# Altium schematic sheet [01] - Connectors.SchDoc
size A2
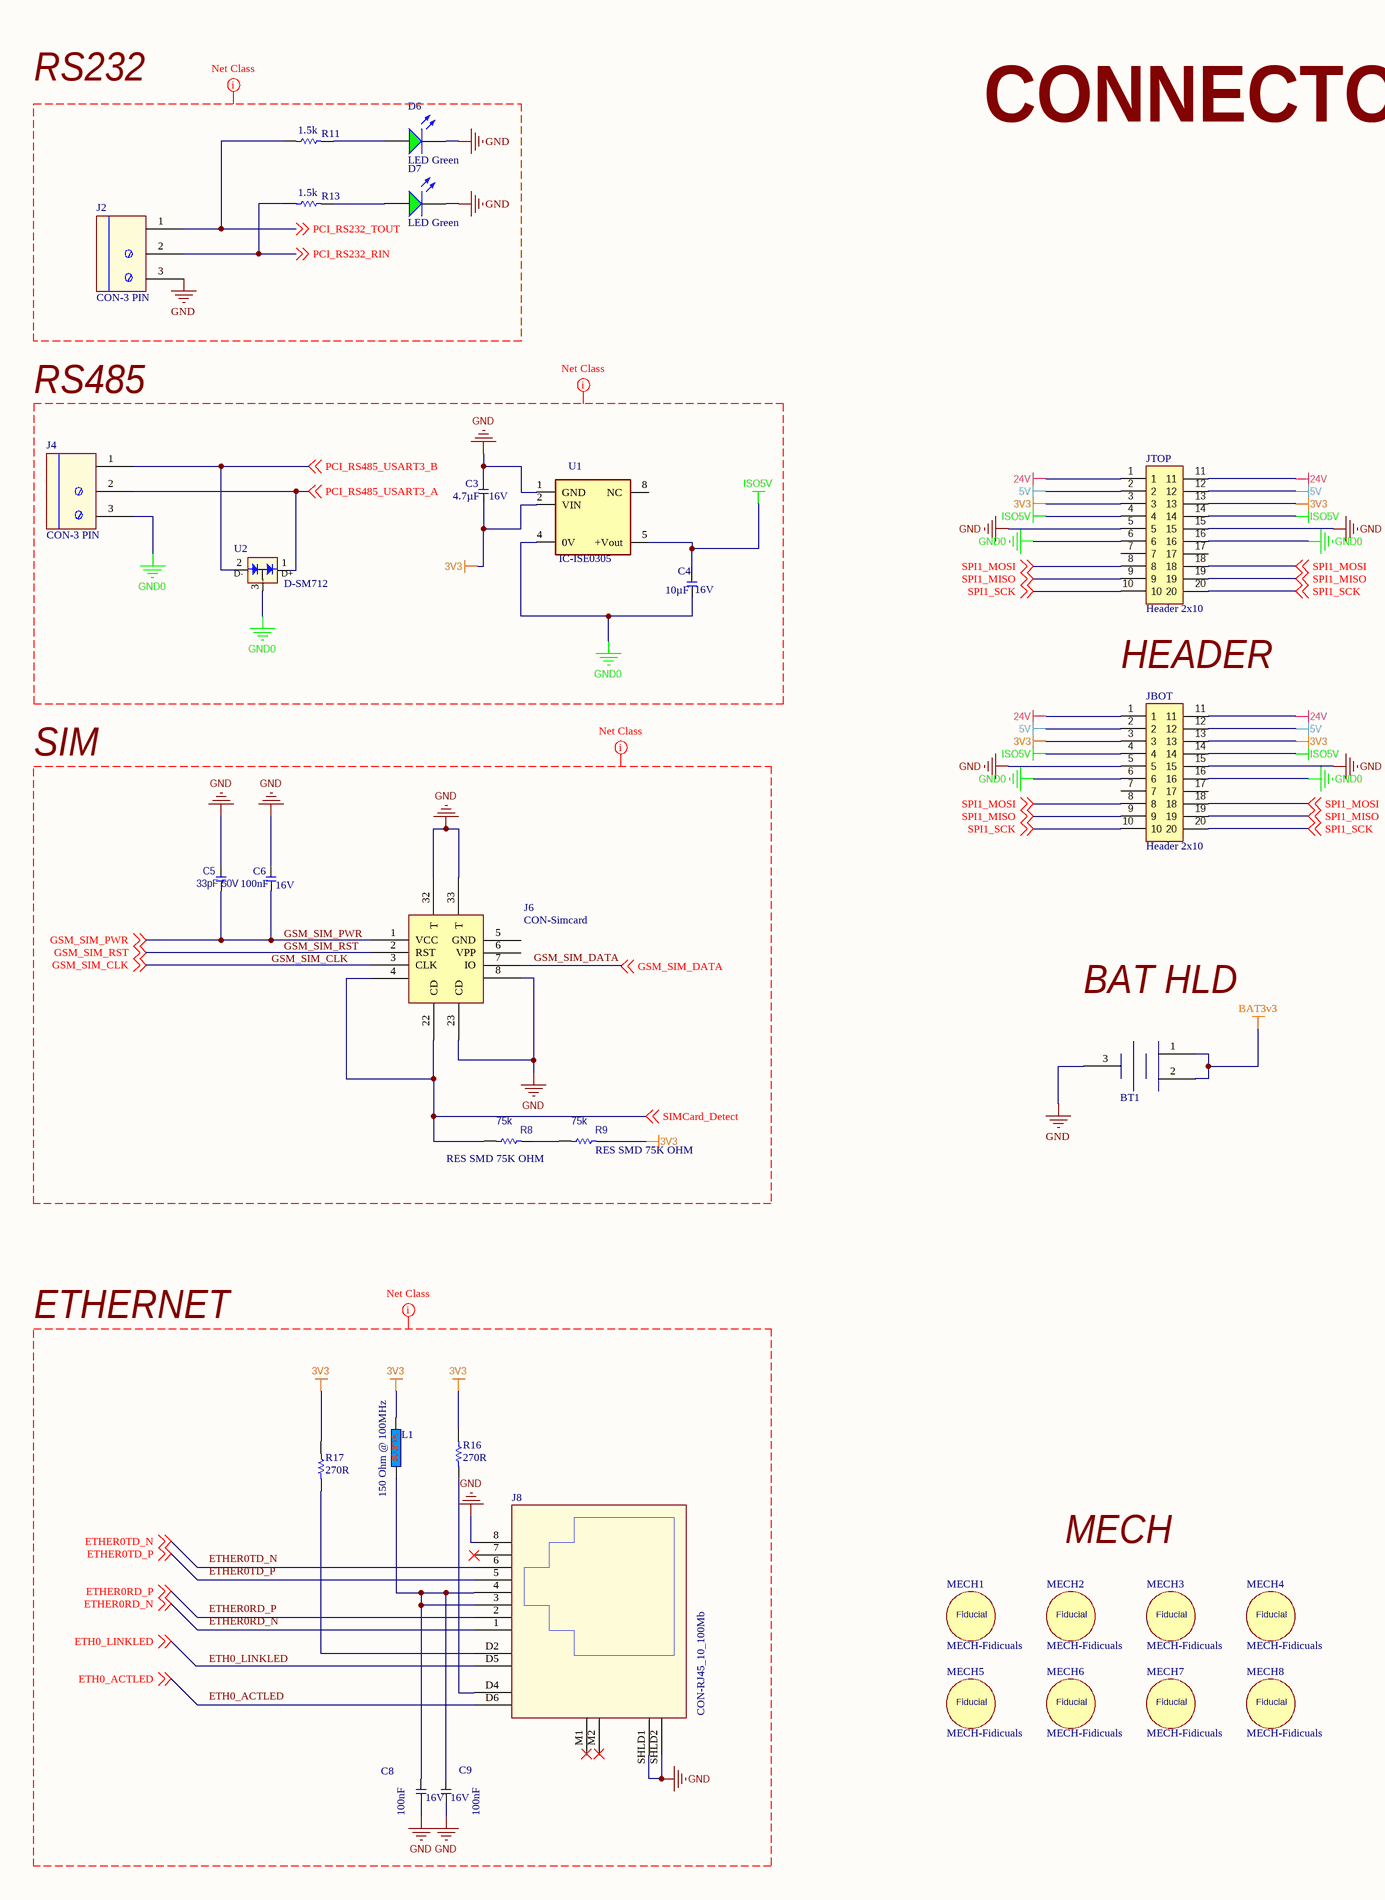
[diagram p0: [01] - Connectors.SchDoc, left]
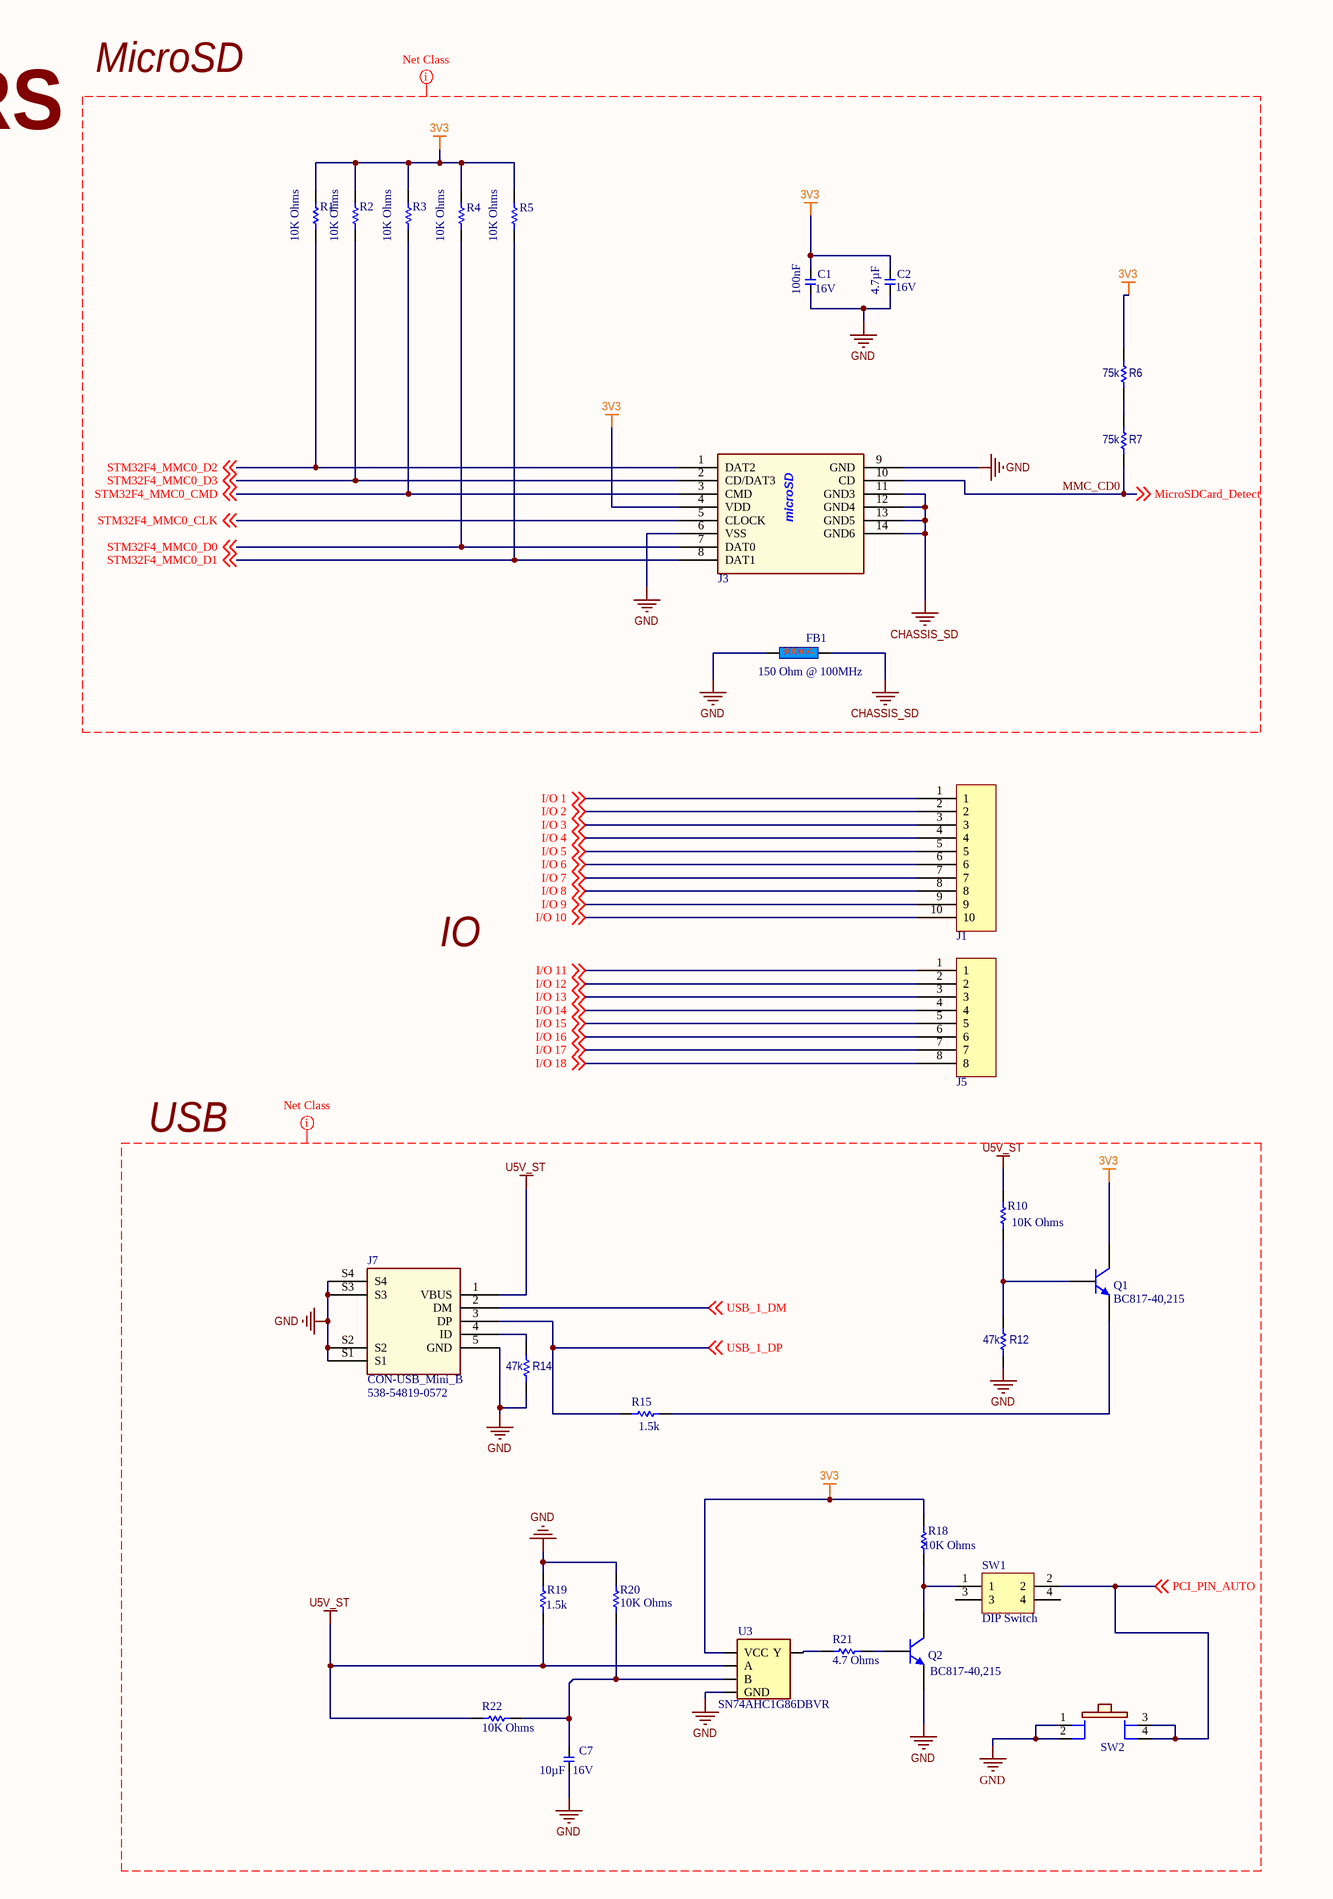
[diagram p1: [01] - Connectors.SchDoc, right]

## Parts
BT1  2032  [2032 SMT Bulk]  (value not drawn)
C1  100nF  Voltage - Rated: 16V  [C0805]
C2  4.7µF  Voltage - Rated: 16V  [C0805]
C3  4.7µF  Voltage - Rated: 16V  [C0805]
C4  10µF  Voltage - Rated: 16V  [C0805]
C5  Capacitance: 33pF  Voltage - Rated: 50V  [C0805]  (hidden comment: CAP CER 33PF 50V)
C6  100nF  Voltage - Rated: 16V  [C0805]
C7  10µF  Voltage - Rated: 16V  [C0805]
C8  100nF  Voltage - Rated: 16V  [C0805]
C9  100nF  Voltage - Rated: 16V  [C0805]
D6  LED Green  [LED_0805]
D7  LED Green  [LED_0805]
FB1  150 Ohm @ 100MHz  [0805]
J1  CON-10 PIN  [Connector_10_pin]  (value not drawn)
J2  CON-3 PIN  [CONECTOR_PCB_3_90_3.81mm]
J3  CONN MICRO SD CARD PUSH-PUSH R/A  [microSD]  (value not drawn)
J4  CON-3 PIN  [CONECTOR_PCB_3_90_3.81mm]
J5  CON-8 PIN  [CONECTOR_PCB_10_3.81_90]  (value not drawn)
J6  CON-Simcard  [SIMCARD]
J7  CON-USB_Mini_B  Supplier Part Number 1: 538-54819-0572  [USB MINI TYPE B]
J8  CON-RJ45_10_100Mb  [6605728-1]
JBOT  Header 2x10  [Header 2x10 2mm]
JTOP  Header 2x10  [Header 2x10 2mm]
L1  150 Ohm @ 100MHz  [0805]
MECH1  MECH-Fidicuals  [T-Fidicuals]
MECH2  MECH-Fidicuals  [T-Fidicuals]
MECH3  MECH-Fidicuals  [T-Fidicuals]
MECH4  MECH-Fidicuals  [T-Fidicuals]
MECH5  MECH-Fidicuals  [T-Fidicuals]
MECH6  MECH-Fidicuals  [T-Fidicuals]
MECH7  MECH-Fidicuals  [T-Fidicuals]
MECH8  MECH-Fidicuals  [T-Fidicuals]
Q1  BC817-40,215  [SO-G3/Y1]
Q2  BC817-40,215  [SO-G3/Y1]
R1  10K Ohms  [R0805]
R2  10K Ohms  [R0805]
R3  10K Ohms  [R0805]
R4  10K Ohms  [R0805]
R5  10K Ohms  [R0805]
R6  Resistance (Ohms): 75k  [R1206]  (hidden comment: RES SMD 75K OHM)
R7  Resistance (Ohms): 75k  [R1206]  (hidden comment: RES SMD 75K OHM)
R8  RES SMD 75K OHM  Resistance (Ohms): 75k  [R1206]
R9  RES SMD 75K OHM  Resistance (Ohms): 75k  [R1206]
R10  10K Ohms  [R0805]
R11  1.5k  [R0805]
R12  Resistance (Ohms): 47k  [R0805]  (hidden comment: RES SMD 47K OHM)
R13  1.5k  [R0805]
R14  Resistance (Ohms): 47k  [R0805]  (hidden comment: RES SMD 47K OHM)
R15  1.5k  [R0805]
R16  270R  [R0805]
R17  270R  [R0805]
R18  10K Ohms  [R0805]
R19  1.5k  [R0805]
R20  10K Ohms  [R0805]
R21  4.7 Ohms  [R0805]
R22  10K Ohms  [R0805]
SW1  DIP Switch  [DIP Switch]
SW2  Switch_Pushbutton_smd  [SW_B3SL-1022P]  (value not drawn)
U1  IC-ISE0305  [DC DC]
U2  D-SM712  [SM712 Sot23-3]
U3  Manufacturer Part Number: SN74AHC1G86DBVR  [SOT23-5]  (hidden comment: IC-SN74AHC1G86DBVR XOR)

## Nets
3V3: C1.2 C2.2 C3.1 J3.4(VDD) JBOT.3 JBOT.13 JTOP.3 JTOP.13 L1.2 Q1.3(C) R1.2 R2.2 R3.2 R4.2 R5.2 R6.2 R9.2 R16.1 R17.2 R18.2 U1.2(VIN) U3.5(VCC)
5V: JBOT.2 JBOT.12 JTOP.2 JTOP.12
24V: JBOT.1 JBOT.11 JTOP.1 JTOP.11
BAT3v3: BT1.1 BT1.2
CHASSIS_SD: FB1.2 J3.11(GND3) J3.12(GND4) J3.13(GND5) J3.14(GND6)
GND: BT1.3 C1.1 C2.1 C3.2 C5.2 C6.2 C7.1 C8.1 C9.1 D6.1(K) D7.1(K) FB1.1 J2.3 J3.6(VSS) J3.9(GND) J6.8 J6.23(CD) J6.32(T) J6.33(T) J7.5(GND) J7.S1 J7.S2 J7.S3 J7.S4 J8.8 J8.SHLD1 J8.SHLD2 JBOT.5 JBOT.15 JTOP.5 JTOP.15 Q2.2(E) R12.2 R14.2 R19.2 R20.2 SW2.1 SW2.2 U1.1(GND) U3.3(GND)
GND0: C4.2 J4.3 JBOT.6 JBOT.16 JTOP.6 JTOP.16 U1.4(0V) U2.3
ISO5V: C4.1 JBOT.4 JBOT.14 JTOP.4 JTOP.14 U1.5(+Vout)
U5V_ST: J7.1(VBUS) R10.2 R19.1 R22.2 U3.1(A)
ETH0_ACTLED: J8.D6 ; off-sheet ETH0_ACTLED
ETH0_LINKLED: J8.D5 ; off-sheet ETH0_LINKLED
ETHER0RD_N: J8.1 ; off-sheet ETHER0RD_N
ETHER0RD_P: J8.2 ; off-sheet ETHER0RD_P
ETHER0TD_N: J8.6 ; off-sheet ETHER0TD_N
ETHER0TD_P: J8.5 ; off-sheet ETHER0TD_P
GSM_SIM_CLK: J6.3(CLK) ; off-sheet GSM_SIM_CLK
GSM_SIM_DATA: J6.7(IO) ; off-sheet GSM_SIM_DATA
GSM_SIM_PWR: C5.1 C6.1 J6.1(VCC) ; off-sheet GSM_SIM_PWR
GSM_SIM_RST: J6.2(RST) ; off-sheet GSM_SIM_RST
I/O 1: J1.1 ; off-sheet I/O 1
I/O 2: J1.2 ; off-sheet I/O 2
I/O 3: J1.3 ; off-sheet I/O 3
I/O 4: J1.4 ; off-sheet I/O 4
I/O 5: J1.5 ; off-sheet I/O 5
I/O 6: J1.6 ; off-sheet I/O 6
I/O 7: J1.7 ; off-sheet I/O 7
I/O 8: J1.8 ; off-sheet I/O 8
I/O 9: J1.9 ; off-sheet I/O 9
I/O 10: J1.10 ; off-sheet I/O 10
I/O 11: J5.1 ; off-sheet I/O 11
I/O 12: J5.2 ; off-sheet I/O 12
I/O 13: J5.3 ; off-sheet I/O 13
I/O 14: J5.4 ; off-sheet I/O 14
I/O 15: J5.5 ; off-sheet I/O 15
I/O 16: J5.6 ; off-sheet I/O 16
I/O 17: J5.7 ; off-sheet I/O 17
I/O 18: J5.8 ; off-sheet I/O 18
MMC_CD0: J3.10(CD) R7.1 ; off-sheet MicroSDCard_Detect  [also labelled MicroSDCard_Detect]
PCI_PIN_AUTO: SW1.2 SW2.3 SW2.4 ; off-sheet PCI_PIN_AUTO
PCI_RS232_RIN: J2.2 R13.1 ; off-sheet PCI_RS232_RIN
PCI_RS232_TOUT: J2.1 R11.1 ; off-sheet PCI_RS232_TOUT
PCI_RS485_USART3_A: J4.2 U2.1(D+) ; off-sheet PCI_RS485_USART3_A
PCI_RS485_USART3_B: J4.1 U2.2(D-) ; off-sheet PCI_RS485_USART3_B
SIMCard_Detect: J6.4 J6.22(CD) R8.1 ; off-sheet SIMCard_Detect
SPI1_MISO: JBOT.9 JBOT.19 JTOP.9 JTOP.19 ; off-sheet SPI1_MISO
SPI1_MOSI: JBOT.8 JBOT.18 JTOP.8 JTOP.18 ; off-sheet SPI1_MOSI
SPI1_SCK: JBOT.10 JBOT.20 JTOP.10 JTOP.20 ; off-sheet SPI1_SCK
STM32F4_MMC0_CLK: J3.5(CLOCK) ; off-sheet STM32F4_MMC0_CLK
STM32F4_MMC0_CMD: J3.3(CMD) R3.1 ; off-sheet STM32F4_MMC0_CMD
STM32F4_MMC0_D0: J3.7(DAT0) R4.1 ; off-sheet STM32F4_MMC0_D0
STM32F4_MMC0_D1: J3.8(DAT1) R5.1 ; off-sheet STM32F4_MMC0_D1
STM32F4_MMC0_D2: J3.1(DAT2) R1.1 ; off-sheet STM32F4_MMC0_D2
STM32F4_MMC0_D3: J3.2(CD/DAT3) R2.1 ; off-sheet STM32F4_MMC0_D3
USB_1_DM: J7.2(DM) ; off-sheet USB_1_DM
USB_1_DP: J7.3(DP) R15.1 ; off-sheet USB_1_DP
NetC7_2: C7.2 R20.1 R22.1 U3.2(B)
NetC8_2: C8.2 C9.2 J8.3 J8.4 L1.1
NetD6_2: D6.2(A) R11.2
NetD7_2: D7.2(A) R13.2
NetJ7_4: J7.4(ID) R14.1
NetJ8_D2: J8.D2 R17.1
NetJ8_D4: J8.D4 R16.2
NetQ1_1: Q1.1(B) R10.1 R12.1
NetQ1_2: Q1.2(E) R15.2
NetQ2_1: Q2.1(B) R21.1
NetQ2_3: Q2.3(C) R18.1 SW1.1
NetR6_1: R6.1 R7.2
NetR8_2: R8.2 R9.1
NetR21_2: R21.2 U3.4(Y)

Not connected (* = marked no-connect by the designer): J6 5(GND) 6(VPP); J8 7* M1 M2; JBOT 7 17; JTOP 7 17; SW1 3 4; U1 8(NC)

## Layout directives
net class RS323: GND, PCI_RS232_RIN, PCI_RS232_TOUT
net class RS485: 3V3, GND, GND0, ISO5V, PCI_RS485_USART3_A, PCI_RS485_USART3_B
net class SIMCARD: 3V3, GND, GSM_SIM_CLK, GSM_SIM_DATA, GSM_SIM_PWR, GSM_SIM_RST, SIMCard_Detect
net class ETHRT: 3V3, ETH0_ACTLED, ETH0_LINKLED, ETHER0RD_N, ETHER0RD_P, ETHER0TD_N, ETHER0TD_P, GND
net class SDCARD: 3V3, CHASSIS_SD, GND, MicroSDCard_Detect, MMC_CD0, STM32F4_MMC0_CLK, STM32F4_MMC0_CMD, STM32F4_MMC0_D0, STM32F4_MMC0_D1, STM32F4_MMC0_D2, STM32F4_MMC0_D3
net class USB: 3V3, GND, PCI_PIN_AUTO, U5V_ST, USB_1_DM, USB_1_DP

## Notes on the sheet
- RS232
- MicroSD
- CONNECTORS
- RS485
- HEADER
- SIM
- IO
- BAT HLD
- USB
- ETHERNET
- MECH
- Labels drawn without touching a wire or pin: ETH0_ACTLED, ETHER0RD_N, ETHER0RD_P, ETHER0TD_N, ETHER0TD_P, GSM_SIM_CLK, GSM_SIM_PWR, GSM_SIM_RST
- (in symbol CON-microSD card) microSD
- (in symbol MECH-Fidicuals) Fiducial

## Library data of the parts
BT1 = CON-Bat SMD 2: HOLDER BATTERY 20MM COIN; Manufacturer: Linx Technologies Inc.; Manufacturer Part Number: BAT-HLD-001-TR; Battery Type, Function: Coin Cell, Retainer; Style: Retainer; Battery Cell Size: Coin, 20.0mm; Number of Cells: 1; Battery Series: 2025, 2032; Supplier 1: Digi-Key; Supplier 2: Digi-Key; RoHS: RoHS Compliant; Category: Battery Products; Stock 2: 0; Pricing 2: 650=0.32625 (USD); Mounting Type: PCB, Surface Mount; Termination Style: SMD (SMT) Tab; Height Above Board: 0.165" (4.20mm); Operating Temperature: -; ComponentLink1URL: https://www.linxtechnologies.com/resources/diagrams/bat-hld-001.pdf; ComponentLink1Description: https://www.linxtechnologies.com/resources/diagrams/bat-hld-001.pdf; Supplier Part Number 1: BAT-HLD-001-ND; Supplier Part Number 2: BAT-HLD-001-TRTR-ND
C1 C6 C8 C9 = C-100NF,16V,0805: AVX - 0805YA103JAT2A - CAP, MLCC, C0G/NP0, 10NF, 16V, 0805; Tolerance: ±5%; Temperature Coefficient: C0G, NP0; Supplier 1: Digi-Key; Manufacturer: AVX; Manufacturer Part Number: 0805YA103JAT2A; RoHS: YES; Stock 1: 28062; Pricing 1: 1=0.29, 10=0.204, 25=0.1668, 50=0.1424, 100=0.1221, 250=0.10176, 500=0.09158, 1000=0.07733 (USD); Capacitance: 100nF; Packaging: Cut Tape (CT); ComponentLink1URL: http://www.avx.com/docs/Catalogs/ccog.pdf; ComponentLink1Description: http://www.avx.com/docs/Catalogs/ccog.pdf; Supplier Part Number 1: 478-1334-1-ND; ComponentLink2URL: http://www.farnell.com/datasheets/1825494.pdf; ComponentLink2Description: http://www.farnell.com/datasheets/1825494.pdf; Category: Capacitors; Mounting Type: Surface Mount, MLCC; Operating Temperature: -55°C ~ 125°C; Applications: General Purpose; Ratings: -; Package / Case: 0805 (2012 Metric); Size / Dimension: 0.079" L x 0.049" W (2.01mm x 1.25mm); Height - Seated (Max): -; Thickness (Max): 0.037" (0.94mm); Lead Spacing: -; Features: -; Lead Style: -; ComponentLink3URL: http://datasheets.avx.com/C0GNP0-Dielectric.pdf; ComponentLink3Description: http://datasheets.avx.com/C0GNP0-Dielectric.pdf
C2 C3 = C-4.7UF,16V,0805: AVX - 0805YC475KAT2A - CAP, MLCC, X7R, 4.7UF, 16V, 0805; Manufacturer: AVX Corporation; Tolerance: ±10%; Supplier 1: Digi-Key; Manufacturer Part Number: 0805YC475KAT2A; RoHS: RoHS Compliant; Stock 1: 16611; Pricing 1: 1=0.78, 10=0.578, 25=0.4952, 50=0.462, 100=0.396, 250=0.363, 500=0.3135, 1000=0.264 (USD); Capacitance: 4.7µF; Packaging: Cut Tape (CT); ComponentLink1URL: http://datasheets.avx.com/X7RDielectric.pdf; ComponentLink1Description: http://datasheets.avx.com/X7RDielectric.pdf; Supplier Part Number 1: 478-5722-1-ND; Category: Capacitors; Temperature Coefficient: X7R; Mounting Type: Surface Mount, MLCC; Operating Temperature: -55°C ~ 125°C; Applications: General Purpose; Ratings: -; Package / Case: 0805 (2012 Metric); Size / Dimension: 0.079" L x 0.049" W (2.01mm x 1.25mm); Height - Seated (Max): -; Thickness (Max): 0.060" (1.52mm); Lead Spacing: -; Features: -; Lead Style: -
C4 C7 = C-10UF,16V,0805: AVX - 0805YD106KAT2A - CAP, MLCC, X5R, 10UF, 16V, 0805; Manufacturer: AVX Corporation; Tolerance: ±10%; Supplier 1: Digi-Key; Manufacturer Part Number: 0805YD106KAT2A; RoHS: RoHS Compliant; Stock 1: 293738; Pricing 1: 1=0.18, 10=0.124, 25=0.0908, 50=0.0742, 100=0.0627, 250=0.05116, 500=0.0429, 1000=0.03795 (USD); Capacitance: 10µF; Packaging: Digi-Reel®; ComponentLink1URL: http://datasheets.avx.com/cx5r.pdf; ComponentLink1Description: http://datasheets.avx.com/cx5r.pdf; Supplier Part Number 1: 478-5165-6-ND; Category: Capacitors; Temperature Coefficient: X5R; Mounting Type: Surface Mount, MLCC; Operating Temperature: -55°C ~ 85°C; Applications: General Purpose; Ratings: -; Package / Case: 0805 (2012 Metric); Size / Dimension: 0.079" L x 0.049" W (2.01mm x 1.25mm); Height - Seated (Max): -; Thickness (Max): 0.055" (1.40mm); Lead Spacing: -; Features: -; Lead Style: -
C5 = C-33PF,0805,50V: CAP CER 33PF 50V NP0 0805; Manufacturer: Samsung Electro-Mechanics America, Inc.; Manufacturer Part Number: CL21C330JBANNNC; Tolerance: ±5%; Temperature Coefficient: C0G, NP0; Supplier 1: Digi-Key; RoHS: RoHS Compliant; Category: Capacitors; Stock 1: 80106; Pricing 1: 1=0.1, 10=0.02, 25=0.0144, 50=0.0108, 100=0.0088, 250=0.00732, 500=0.00626, 1000=0.00492 (USD); Package / Case: 0805 (2012 Metric); Packaging: Cut Tape (CT); ComponentLink1URL: http://www.samsungsem.com/kr/support/product-search/mlcc/__icsFiles/afieldfile/2016/08/18/S_CL21C330JBANNNC.pdf; ComponentLink1Description: http://www.samsungsem.com/kr/support/product-search/mlcc/__icsFiles/afieldfile/2016/08/18/S_CL21C330JBANNNC.pdf; Supplier Part Number 1: 1276-1105-1-ND; Part Status: Active; Mounting Type: Surface Mount, MLCC; Operating Temperature: -55°C ~ 125°C; Applications: General Purpose; Ratings: -; Size / Dimension: 0.079" L x 0.049" W (2.00mm x 1.25mm); Height - Seated (Max): -; Thickness (Max): 0.030" (0.75mm); Lead Spacing: -; Features: -; Lead Style: -
D6 D7 = LED-Green SMD 20mA 2V 0805: LED Green SMD 20mA 2V 0805; TIIntPartnumber: 1F0008; MfrNum: 598-8170-107F; Mfr: Dialight; PartName: LEDGreen2x1.5; Cost10K: 0.052; Cost100: 0.081; Vendor: Digikey; DescriptiveText: LED Green SMD 20mA 2V 0805; Descriptive_Text: LED Green SMD 20mA 2V 0805; Supplier 1: Farnell; Supplier Part Number 1: 2127741
FB1 L1 = L-150OHM,800MA: FERRITE 800MA 150 OHM 0805 SMD; Manufacturer: Laird-Signal Integrity Products; Manufacturer Part Number: LI0805H151R-10; DC Resistance (DCR): 150 mOhm Max; Filter Type: Differential Mode - Single; Supplier 1: Digi-Key; RoHS: RoHS Compliant; Category: Filters; Stock 1: 418596; Pricing 1: 1=0.1, 10=0.07, 25=0.064, 50=0.0574, 100=0.0421, 250=0.03064, 500=0.02808, 1000=0.02424 (USD); Packaging: Cut Tape (CT); Impedance @ Frequency: 150 Ohm @ 100MHz; Current Rating: 800mA; Package / Case: 0805 (2012 Metric); Mounting Type: Surface Mount; Height (Max): 0.043" (1.10mm); Size / Dimension: 0.079" L x 0.049" W (2.00mm x 1.25mm); ComponentLink1URL: http://www.lairdtech.com/WorkArea/linkit.aspx?LinkIdentifier=id&ItemID=4912; ComponentLink1Description: http://www.lairdtech.com/WorkArea/linkit.aspx?LinkIdentifier=id&ItemID=4912; Supplier Part Number 1: 240-2384-1-ND
J1 = CON-10 PIN: Terminal Block 4 Pin
J2 J4 = CON-3 PIN: Terminal Block 3 Pin
J3 = CON-microSD card: MOLEX 5027740891; Manufacturer: Molex, LLC; Card Type: Secure Digital - microSD™; Number of Positions: 10 (8 + 2); Connector Type: Connector and Ejector; Insertion, Removal Method: Push In, Push Out; Supplier 1: Digi-Key; Manufacturer Part Number: 5027740891; RoHS: RoHS Compliant; Category: Connectors, Interconnects; Stock 1: 0; Pricing 1: 1000=1.91922, 2000=1.85304, 3000=1.78686, 5000=1.72068 (USD); Packaging: Tape & Reel (TR); Ejector Side: -; Mounting Type: Surface Mount, Right Angle; Features: Switch; Height Above Board: 0.071" (1.80mm); Mounting Feature: Reverse - Bottom; Contact Finish: Gold; Contact Finish Thickness: 20µin (0.51µm); ComponentLink1URL: http://www.molex.com/pdm_docs/sd/5027740891_sd.pdf; ComponentLink1Description: http://www.molex.com/pdm_docs/sd/5027740891_sd.pdf; Supplier Part Number 1: WM24066TR-ND
J5 = CON-8 PIN: Terminal Block 8 Pin
J7 = CON-USB_Mini_B: Connector MicroUSB AB; TIIntPartnumber: 2C0088; MfrNum: ZX62-AB-5PA(11); Mfr: Hirose; Manufacturer: Molex; Manufacturer Part Number: 54819-0572; DescriptiveText: Connector Micro USB AB RA; Cost10K: 0.26; Cost100: 0.67; Vendor: Digikey; Connector Type: Mini USB Type B Receptacle; Current Rating: 1 A; Gender: Female; Mounting Angle: Right; Number of Contacts: 5; Voltage Rating: 30 V; Insulator Colour: Black; Number of Ports: 1; Insulation Resistance: 100 MOhms; PartName: ConnectorMicroUSBAB; Descriptive_Text: Connector Micro USB AB RA; Supplier 1: Mouser; RoHS: RoHS Compliant; Category: USB Connectors; Stock 1: 15341; Pricing 1: 1=1.46, 10=1.35, 25=1.24, 50=1.19, 100=1.11, 250=0.999, 500=0.847, 800=0.723, 1600=0.704 (USD); Color: Black; Contact Plating: Gold; Features: Metal shielding for ESD protection; Operating Temperature Range: 0 C to + 50 C; Packaging: Reel; Product: Mini USB Type B Connectors; Series: 54819; Termination Style: Solder Tab; Brand: Molex; Contact Material: Copper Alloy; Flammability Rating: UL 94 V-0; Product Category: USB Connectors; Standard: USB; Standard Pack Qty: 800; RoHS - Mouser: Y; Minimum Order Quantity: 1; Reeling: True; ComponentLink1URL: http://www.mouser.com/ds/2/276/0548190572_IO_CONNECTORS-228789.pdf; ComponentLink1Description: http://www.mouser.com/ds/2/276/0548190572_IO_CONNECTORS-228789.pdf
J8 = CON-RJ45_10_100Mb: Connector MagRJ-45 Jack w/LED 10_100Mb
JBOT JTOP = Header 2x10 2mm: CONN HEADER 2MM SMD AU 20POS; Manufacturer: Harwin Inc.; Manufacturer Part Number: M22-5320505; Connector Type: Header, Unshrouded, Breakaway; Number of Positions: 10; Number of Positions Loaded: All; Pitch: 0.079" (2.00mm); RoHS: RoHS Compliant; Category: Connectors, Interconnects; Packaging: Tube; Contact Type: Male Pin; Number of Rows: 2; Row Spacing: 0.079" (2.00mm); Contact Mating Length: 0.138" (3.50mm); Mounting Type: Surface Mount; Termination: Solder; Fastening Type: -; Features: -; Contact Finish: Gold; Contact Finish Thickness: -; Color: Black; ComponentLink1URL: http://cdn.harwin.com/pdfs/M22-532.pdf; ComponentLink1Description: http://cdn.harwin.com/pdfs/M22-532.pdf; Supplier 1: Digi-Key; Stock 1: 1131; Pricing 1: 1=1.8, 10=1.607, 100=1.323, 500=1.0458, 1000=0.89775, 5000=0.819, 10000=0.7875 (USD); Supplier Part Number 1: 952-1344-ND
MECH1-MECH8 = MECH-Fidicuals: Fidicuals
Q1 Q2 = T-BC817-40 NPN: TRANS NPN 45V 0.5A SOT23; Manufacturer: NXP Semiconductors; Current - Collector (Ic) (Max): 500mA; Vce Saturation (Max) @ Ib, Ic: 700mV @ 50mA, 500mA; Current - Collector Cutoff (Max): 100nA (ICBO); DC Current Gain (hFE) (Min) @ Ic, Vce: 250 @ 100mA, 1V; Power - Max: 250mW; Frequency - Transition: 100MHz; Supplier 1: Digi-Key; Manufacturer Part Number: BC817-40,215; RoHS: RoHS Compliant; Category: Discrete Semiconductor Products; Stock 1: 130982; Pricing 1: 1=0.14, 10=0.127, 100=0.0693, 500=0.04258, 1000=0.02905 (USD); Packaging: Cut Tape (CT); ComponentLink1URL: http://www.nxp.com/documents/data_sheet/BC817_BC817W_BC337.pdf; ComponentLink1Description: http://www.nxp.com/documents/data_sheet/BC817_BC817W_BC337.pdf; Supplier Part Number 1: 568-1631-1-ND; Transistor Type: NPN; Voltage - Collector Emitter Breakdown (Max): 45V; Mounting Type: Surface Mount; Package / Case: TO-236-3, SC-59, SOT-23-3; Supplier Device Package: SOT-23 (TO-236AB)
R1-R5 R10 R18 R20 R22 = R-10K,0805: BOURNS - CR0805-FX-1002GLF - RESISTOR, 10K, 0.125W, 1%; Product Range: BOURNS - CR Series; Power Rating: 125; Resistor Case Style: 0805 [2012 Metric]; Resistor Element Material: Thick Film; Temperature Coefficient: ± 100; Voltage Rating: 150; SVHC: No SVHC (16-Jun-2014); Resistor Mounting: SMD<!--FANDB--><div class="features-and-benefits-container"></div>; Supplier 1: Farnell; Manufacturer: BOURNS; Manufacturer Part Number: CR0805-FX-1002GLF; RoHS: YES; Stock 1: 23336; Pricing 1: 50=0,0299, 250=0,0234, 1000=0,0221, 5000=0,0156, 10000=0,0143 (EUR); Resistance: 10K Ohms; Resistance Tolerance: ± 1%; Packaging: Cut Tape; MSL: MSL 1 - Unlimited; ComponentLink1URL: http://www.farnell.com/datasheets/1845293.pdf; ComponentLink1Description: http://www.farnell.com/datasheets/1845293.pdf; Supplier Part Number 1: 2008384
R6-R9 = R-75k,1206: RES SMD 75K OHM 1% 1/4W 1206; Manufacturer: Vishay Dale; Manufacturer Part Number: CRCW120675K0FKEA; Temperature Coefficient: ±100ppm/°C; Power (Watts): 0.25W, 1/4W; Supplier 1: Digi-Key; RoHS: RoHS Compliant; Category: Resistors; Stock 1: 28544; Pricing 1: 1=0.1, 10=0.054, 25=0.0392, 50=0.03, 100=0.0221, 250=0.01684, 500=0.01346, 1000=0.00991, 2500=0.0086 (USD); Height: 0.024" (0.60mm); Package / Case: 1206 (3216 Metric); Packaging: Cut Tape (CT); Tolerance: ±1%; ComponentLink1URL: http://www.vishay.com/docs/20035/dcrcwe3.pdf; ComponentLink1Description: http://www.vishay.com/docs/20035/dcrcwe3.pdf; Supplier Part Number 1: 541-75.0KFCT-ND; Part Status: Active; Composition: Thick Film; Features: Automotive AEC-Q200; Operating Temperature: -55°C ~ 155°C; Supplier Device Package: 1206; Size / Dimension: 0.126" L x 0.063" W (3.20mm x 1.60mm); Number of Terminations: 2; Failure Rate: -
R11 R13 R15 R19 = R-1.5K,%1,0805: RES SMD 1.5K OHM 1% 1/8W 0805; Manufacturer: Yageo; Manufacturer Part Number: RC0805FR-071K5L; Temperature Coefficient: ±100ppm/°C; Power (Watts): 0.125W, 1/8W; Supplier 1: Digi-Key; RoHS: RoHS Compliant; Stock 1: 815764; Pricing 1: 1=0.1, 10=0.021, 25=0.0152, 100=0.0084, 250=0.00644, 500=0.00514, 1000=0.00379, 2500=0.00329 (USD); Packaging: Digi-Reel®; ComponentLink1URL: http://www.yageo.com/documents/recent/PYu-RC_Group_51_RoHS_L_04.pdf; ComponentLink1Description: http://www.yageo.com/documents/recent/PYu-RC_Group_51_RoHS_L_04.pdf; Supplier Part Number 1: 311-1.50KCRDKR-ND; Category: Resistors; Tolerance: ±1%; Composition: Thick Film; Features: Moisture Resistant; Operating Temperature: -55°C ~ 155°C; Package / Case: 0805 (2012 Metric); Supplier Device Package: 0805; Size / Dimension: 0.079" L x 0.049" W (2.00mm x 1.25mm); Height: 0.024" (0.60mm); Number of Terminations: 2; Resistance (Ohms): 1.5k
R12 R14 = R-47K,0805: RES SMD 47K OHM 1% 1/8W 0805; Manufacturer: Samsung Electro-Mechanics America, Inc.; Manufacturer Part Number: RC2012F473CS; Temperature Coefficient: ±100ppm/°C; Power (Watts): 0.125W, 1/8W; Regulator Topology: Positive Adjustable; Voltage - Output: 1.24 V ~ 15 V; Current - Output: 3A; Voltage - Dropout (Typical): 0.45V @ 3A; Number of Regulators: 1; Voltage - Input: 3 V ~ 16 V; Supplier 1: Digi-Key; RoHS: RoHS Compliant; Category: Resistors; Stock 1: 29088; Pricing 1: 1=0.1, 10=0.022, 25=0.016, 50=0.0124, 100=0.0091, 500=0.00554, 1000=0.00408 (USD); Package / Case: 0805 (2012 Metric); Packaging: Cut Tape (CT); Tolerance: ±1%; ComponentLink1URL: http://media.digikey.com/pdf/Data%20Sheets/Samsung%20PDFs/RC_Series_ds.pdf; ComponentLink1Description: http://media.digikey.com/pdf/Data%20Sheets/Samsung%20PDFs/RC_Series_ds.pdf; Supplier Part Number 1: 1276-5377-1-ND; Part Status: Active; Composition: Thick Film; Features: Moisture Resistant; Operating Temperature: -55°C ~ 155°C; Supplier Device Package: 0805; Size / Dimension: 0.079" L x 0.049" W (2.00mm x 1.25mm); Height: 0.024" (0.60mm); Number of Terminations: 2; Failure Rate: -; Current - Limit (Min): 3A; Mounting Type: Surface Mount; ComponentLink2URL: http://www.microchip.com/mymicrochip/filehandler.aspx?ddocname=en580808; ComponentLink2Description: http://www.microchip.com/mymicrochip/filehandler.aspx?ddocname=en580808
R16 R17 = R-270R,0805: TE CONNECTIVITY / NEOHM 270R Thin Film; Manufacturer Part Number: CPF0805B270RE1; Product Range: TE CONNECTIVITY - CPF Series; Resistance: 270 Ohms; Power Rating: 100; Resistance Tolerance: ± 0.1%; Resistor Case Style: 0805 [2012 Metric]; Temperature Coefficient: ± 25; Voltage Rating: 200; External Depth: 0.5; External Length / Height: 2; External Width: 1.25; Resistor Mounting: SMD; Supplier 1: Farnell; Manufacturer: TE CONNECTIVITY / NEOHM; RoHS: YES; Stock 1: 755; Pricing 1: 10=0,43, 50=0,34, 100=0,32, 500=0,27, 1000=0,24 (EUR); Resistor Element Material: Thin Film; Packaging: Cut Tape; MSL: -; No. of Pins: 2; Operating Temperature Max: 155; Operating Temperature Min: -55; Operating Temperature Range: -55°C to +155; Series: CPF<!--FANDB--><div class="features-and-benefits-container"></div>; ComponentLink1URL: http://www.tycoelectronics.com/commerce/DocumentDelivery/DDEController?Action=srchrtrv&DocNm=1614884&DocType=Customer+Drawing&DocLang=English; ComponentLink1Description: http://www.tycoelectronics.com/commerce/DocumentDelivery/DDEController?Action=srchrtrv&DocNm=1614884&DocType=Customer+Drawing&DocLang=English; ComponentLink2URL: http://www.tycoelectronics.com/commerce/DocumentDelivery/DDEController?Action=srchrtrv&DocNm=1773200&DocType=Data+Sheet&DocLang=English; ComponentLink2Description: http://www.tycoelectronics.com/commerce/DocumentDelivery/DDEController?Action=srchrtrv&DocNm=1773200&DocType=Data+Sheet&DocLang=English; Supplier Part Number 1: 1697424
R21 = R-4.7K,0805: BOURNS - CR0805-FX-4701GLF - RESISTOR, 4.7K, 0.125W, 1%; Product Range: BOURNS - CR Series; Power Rating: 125; Resistor Case Style: 0805 [2012 Metric]; Resistor Element Material: Thick Film; Temperature Coefficient: ± 100; Voltage Rating: 150; SVHC: No SVHC (16-Jun-2014); Resistor Mounting: SMD<!--FANDB--><div class="features-and-benefits-container"></div>; Supplier 1: Farnell; Manufacturer: BOURNS; Manufacturer Part Number: CR0805-FX-4701GLF; RoHS: YES; Stock 1: 20050; Pricing 1: 50=0,0312, 250=0,0247, 1000=0,0234, 5000=0,0156, 10000=0,0143 (EUR); Resistance: 4.7 Ohms; Resistance Tolerance: ± 1%; Packaging: Cut Tape; MSL: MSL 1 - Unlimited; ComponentLink1URL: http://www.farnell.com/datasheets/1845293.pdf; ComponentLink1Description: http://www.farnell.com/datasheets/1845293.pdf; Supplier Part Number 1: 2008383
SW1 = DIP Switch KAS2102E: SWITCH SLIDE DIP SPST 25MA 24V; Manufacturer: E-Switch; Manufacturer Part Number: KAS2102ET; Number of Positions: 2; Voltage Rating: 24VDC; Actuator Type: Slide (Standard); Actuator Level: Raised; Pitch: 0.100" (2.54mm), Full; Washable: Yes; Body Material: Polybutylene Terephthalate (PBT), Glass Filled; Mechanical Life: 2,000 Cycles; Supplier 1: Digi-Key; RoHS: RoHS Compliant; Category: Switches; Stock 1: 10973; Pricing 1: 1=1.47, 10=1.387, 50=1.2452, 100=1.2169, 250=1.0754, 500=1.0188, 1000=0.9056, 5000=0.7924 (USD); Packaging: Tube; Circuit: SPST; Current Rating: 25mA; Contact Material: Phosphor Bronze; Contact Finish: Gold; Height Above Board: 0.389" (9.90mm); Mounting Type: Through Hole, Right Angle; Termination Style: PC Pin; Features: Tape Seal; Length: 0.254" (6.44mm); Operating Temperature: -40°C ~ 85°C; Electrical Life: 2,000 Cycles; ComponentLink1URL: http://spec_sheets.e-switch.com/specs/N321021.pdf; ComponentLink1Description: http://spec_sheets.e-switch.com/specs/N321021.pdf; Supplier Part Number 1: EG4507-ND
SW2 = Switch_Pushbutton_smd: Switch Push Button tactile; TIIntPartnumber: 2W0018; MfrNum: B3SL-1022P; Mfr: Omron; PartName: SwitchPushMomTactilesmd; Cost10K: 0.25; Cost100: 0.340; Vendor: Digikey; DescriptiveText: Switch Push Button tactile; Descriptive_Text: Switch Push Button tactile
U1 = IC-ISE0305: DC/DC CONV 5V 1W; Manufacturer: XP Power; Manufacturer Part Number: ISE0305A; Number of Outputs: 1; Voltage - Input (Min): 2.97V; Voltage - Input (Max): 3.63V; Current - Output (Max): 200mA; Voltage - Isolation: 1.5kV (1500V); Efficiency: 74%; Supplier 1: Farnell; Supplier Part Number 1: 2475756; Supplier 2: Digi-Key; RoHS: RoHS Compliant; Category: Power Supplies - Board Mount; Stock 2: 44; Pricing 2: 1=4.25, 5=4.12, 10=4, 25=3.83, 100=3.57, 500=3.32 (USD); Packaging: Tube; Type: Isolated Module; Voltage - Output 1: 5V; Voltage - Output 2: -; Voltage - Output 3: -; Power (Watts) - Manufacture Series: 1W; Applications: ITE (Commercial); Features: SCP; Mounting Type: Surface Mount; Package / Case: 8-SMD Module (5 Leads); Size / Dimension: 0.50" L x 0.44" W x 0.29" H (12.7mm x 11.2mm x 7.3mm); Operating Temperature: -40°C ~ 105°C; Power (Watts) - Max: 1W; ComponentLink1URL: http://www.xppower.com/Portals/0/pdfs/SF_ISE.pdf; ComponentLink1Description: http://www.xppower.com/Portals/0/pdfs/SF_ISE.pdf; Supplier Part Number 2: 1470-2973-5-ND
U2 = D-SM712: TVS DIODE 12VWM 21VC SOT23; Manufacturer: Micro Commercial Co; Manufacturer Part Number: SM712-TP; Bidirectional Channels: 2; Voltage - Reverse Standoff (Typ): 12V (Max); Voltage - Breakdown (Min): 13.3V; Voltage - Clamping (Max) @ Ipp: 21V; Current - Peak Pulse (10/1000µs): 5A (8/20µs); Power - Peak Pulse: 400W; Power Line Protection: No; Capacitance @ Frequency: 45pF @ 1MHz; Supplier 1: Digi-Key; RoHS: RoHS Compliant; Category: Circuit Protection; Stock 1: 35845; Pricing 1: 1=1.08, 10=0.957, 25=0.864, 100=0.756, 250=0.663, 500=0.588, 1000=0.465 (USD); Packaging: Cut Tape (CT); Type: Zener; Unidirectional Channels: -; Applications: General Purpose; Operating Temperature: -55°C ~ 150°C (TJ); Mounting Type: Surface Mount; Package / Case: TO-236-3, SC-59, SOT-23-3; Supplier Device Package: SOT-23; ComponentLink1URL: http://www.mccsemi.com/up_pdf/SM712(SOT-23).pdf; ComponentLink1Description: http://www.mccsemi.com/up_pdf/SM712(SOT-23).pdf; Supplier Part Number 1: SM712-TPMSCT-ND
U3 = IC-SN74AHC1G86DBVR XOR: IC GATE XOR 1CH 2-INP SOT-23-5; Manufacturer: Texas Instruments; Logic Type: XOR (Exclusive OR); Number of Circuits: 1; Number of Inputs: 2; Voltage - Supply: 2 V ~ 5.5 V; Current - Quiescent (Max): 1µA; Current - Output High, Low: 8mA, 8mA; Logic Level - Low: 0.5 V ~ 1.65 V; Logic Level - High: 1.5 V ~ 3.85 V; Max Propagation Delay @ V, Max CL: 8.8ns @ 5V, 50pF; Supplier 1: Digi-Key; RoHS: RoHS Compliant; Category: Integrated Circuits (ICs); Stock 1: 12192; Pricing 1: 1=0.36, 10=0.29, 100=0.198, 500=0.1482, 1000=0.111 (USD); Packaging: Cut Tape (CT); Features: -; Operating Temperature: -40°C ~ 85°C; Mounting Type: Surface Mount; Supplier Device Package: SOT-23-5; Package / Case: SC-74A, SOT-753; ComponentLink1URL: http://www.ti.com/lit/ds/symlink/sn74ahc1g86.pdf; ComponentLink1Description: http://www.ti.com/lit/ds/symlink/sn74ahc1g86.pdf; Supplier Part Number 1: 296-1094-6-ND